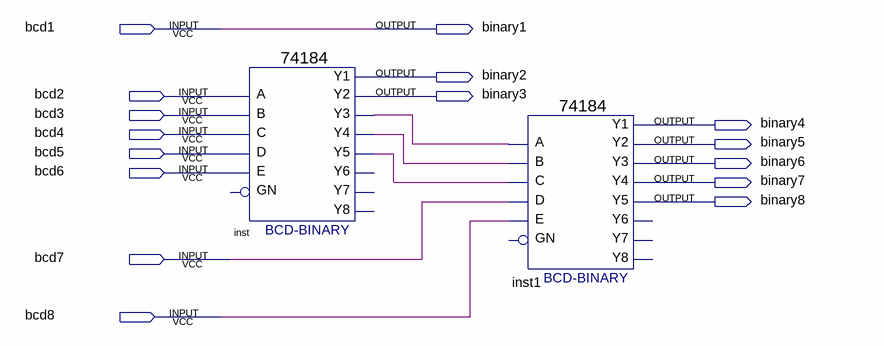
[diagram p0: schematic sheet]
// Quartus schematic BCD2BINARY.bdf as structural Verilog: 2 symbols, 16 pins
module BCD2BINARY (
  input  bcd1,
  input  bcd2,
  input  bcd3,
  input  bcd4,
  input  bcd5,
  input  bcd6,
  input  bcd7,
  input  bcd8,
  output binary1,
  output binary2,
  output binary3,
  output binary4,
  output binary5,
  output binary6,
  output binary7,
  output binary8
);

  wire inst_y3, inst_y4, inst_y5;

  \74184  inst (
    .D(bcd5), .A(bcd2), .B(bcd3), .C(bcd4), .E(bcd6), .Y5(inst_y5), .Y3(inst_y3), .Y4(inst_y4), .Y2(binary3),
    .Y1(binary2));  // open: GN, Y6, Y7, Y8
  \74184  inst1 (
    .D(bcd7), .A(inst_y3), .B(inst_y4), .C(inst_y5), .E(bcd8), .Y5(binary8), .Y3(binary6), .Y4(binary7),
    .Y2(binary5), .Y1(binary4));  // open: GN, Y6, Y7, Y8

  assign binary1 = bcd1;
endmodule
